# EAGLE design extension (EAGLE 9.0.0)
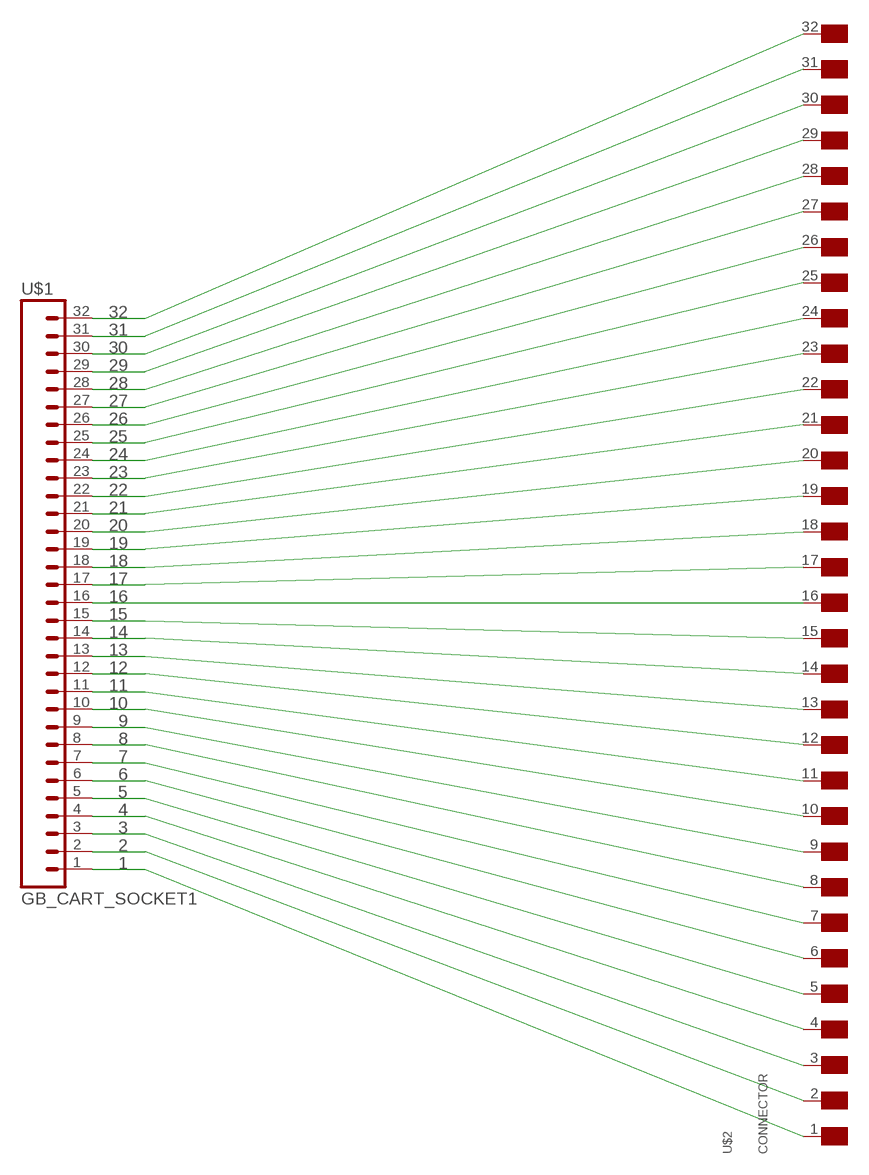
[diagram p0: schematic, sheet 1]

## Parts
U$1  GB_CART_SOCKET1  [GB_CART_SOCKET]
U$2  CONNECTOR  [CONNECTOR]

## Nets
1: U$1.1 U$2.1(VDD)
2: U$1.2 U$2.2(CLK)
3: U$1.3 U$2.3(/WR)
4: U$1.4 U$2.4(/RD)
5: U$1.5 U$2.5(/RCS)
6: U$1.6 U$2.6(A0)
7: U$1.7 U$2.7(A1)
8: U$1.8 U$2.8(A2)
9: U$1.9 U$2.9(A3)
10: U$1.10 U$2.10(A4)
11: U$1.11 U$2.11(A5)
12: U$1.12 U$2.12(A6)
13: U$1.13 U$2.13(A7)
14: U$1.14 U$2.14(A8)
15: U$1.15 U$2.15(A9)
16: U$1.16 U$2.16(A10)
17: U$1.17 U$2.17(A11)
18: U$1.18 U$2.18(A12)
19: U$1.19 U$2.19(A13)
20: U$1.20 U$2.20(A14)
21: U$1.21 U$2.21(A15)
22: U$1.22 U$2.22(D0)
23: U$1.23 U$2.23(D1)
24: U$1.24 U$2.24(D2)
25: U$1.25 U$2.25(D3)
26: U$1.26 U$2.26(D4)
27: U$1.27 U$2.27(D5)
28: U$1.28 U$2.28(D6)
29: U$1.29 U$2.29(D7)
30: U$1.30 U$2.30(/RS)
31: U$1.31 U$2.31(AUDIO)
32: U$1.32 U$2.32(GND)

## Library data of the parts
U$1 = gameboy:GB_CART_SOCKET
U$2 = gameboy:CONNECTOR: Connector Pads for Gameboy Cartridges

## Net classes
0 default: width 1.016 mm

## Board
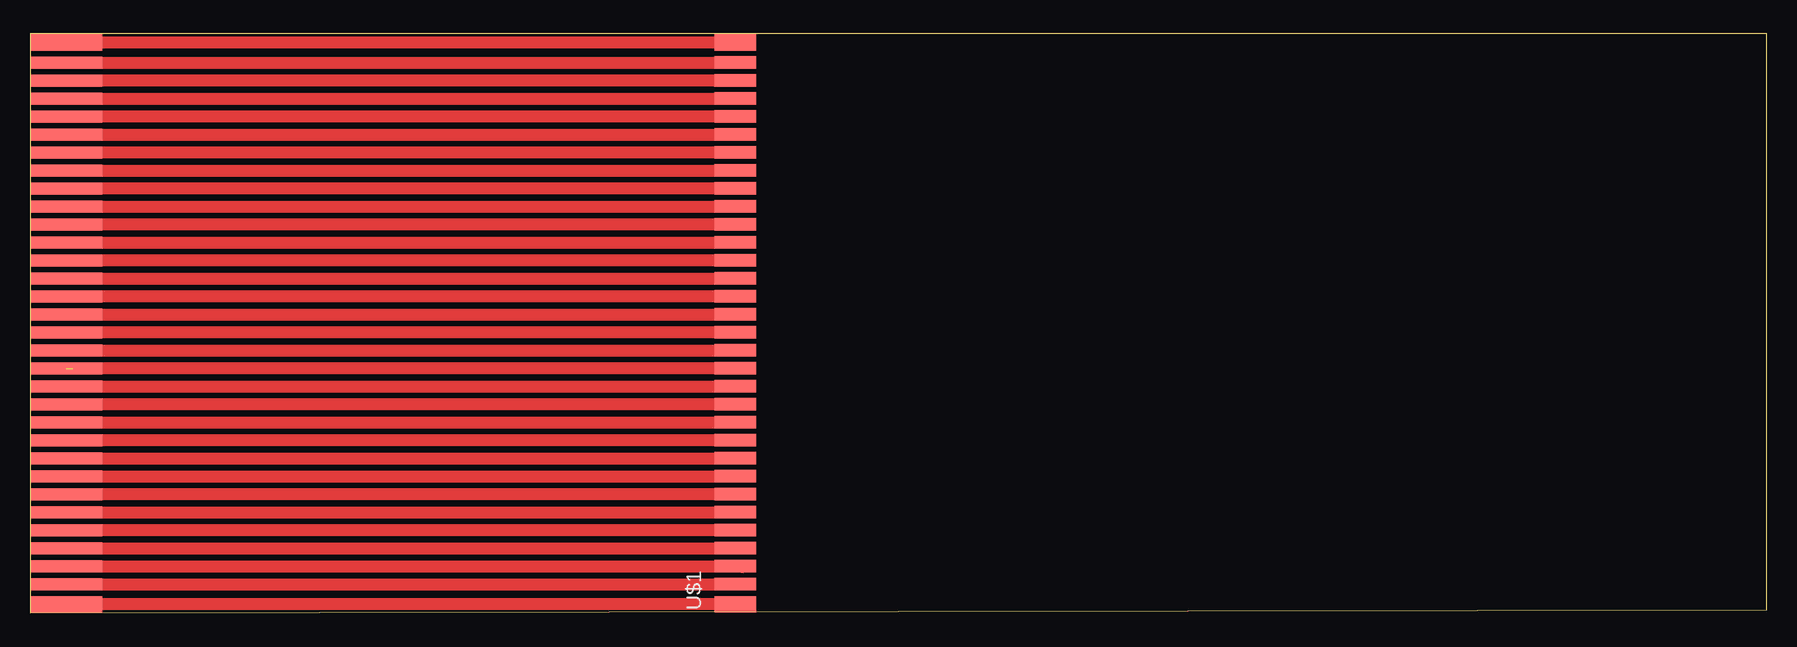
[diagram p1: board, top side]

Size 144.78 x 48.3 mm. Coordinates in mm from the lower left corner, seen from the top.
Outline: 0,0 144.78,0.25 144.78,48.3 0,48.3 0,0
Copper layers (1*16): Top 0.035mm / dielectric 1.5mm / Bottom 0.035mm
Design rules "default": minimum track width 6mil, minimum drill 0.35mm, track to track 6mil, track to pad 6mil, pad to pad 6mil, via to via 6mil, smd to smd 6mil, copper to edge 40mil, drill to drill 6mil, minimum pad ring 10mil, minimum via ring 8mil, stop-mask expansion 4mil, vias tented up to drill 0mil, thermal gap 10mil

### Footprints (pad centres in the part's own frame; a part is rotated, then mirrored left to right if it is on the bottom)
GB_CART_SOCKET = smd 1.36 x 3.46: 1 -22.895,-0.12; 32 23.94,-0.12 | smd 1.03 x 3.46: 2 -21.225,-0.12; 3 -19.725,-0.12; 4 -18.225,-0.12; 5 -16.725,-0.12; 6 -15.225,-0.12; 7 -13.725,-0.12; 8 -12.225,-0.12; 9 -10.725,-0.12; 10 -9.225,-0.12; 11 -7.725,-0.12; 12 -6.225,-0.12; 13 -4.725,-0.12; 14 -3.225,-0.12; 15 -1.725,-0.12; 16 -0.225,-0.12; 17 1.275,-0.12; 18 2.775,-0.12; 19 4.275,-0.12; 20 5.775,-0.12; 21 7.275,-0.12; 22 8.775,-0.12; 23 10.275,-0.12; 24 11.775,-0.12; 25 13.275,-0.12; 26 14.775,-0.12; 27 16.275,-0.12; 28 17.775,-0.12; 29 19.275,-0.12; 30 20.775,-0.12; 31 22.275,-0.12
CONNECTOR = smd 1.4 x 6: 1 0.7,-3; 32 47.6,-3 | smd 1 x 6: 2 2.4,-3; 3 3.9,-3; 4 5.4,-3; 5 6.9,-3; 6 8.4,-3; 7 9.9,-3; 8 11.4,-3; 9 12.9,-3; 10 14.4,-3; 11 15.9,-3; 12 17.4,-3; 13 18.9,-3; 14 20.4,-3; 15 21.9,-3; 16 23.4,-3; 17 24.9,-3; 18 26.4,-3; 19 27.9,-3; 20 29.4,-3; 21 30.9,-3; 22 32.4,-3; 23 33.9,-3; 24 35.4,-3; 25 36.9,-3; 26 38.4,-3; 27 39.9,-3; 28 41.4,-3; 29 42.9,-3; 30 44.4,-3; 31 45.9,-3

### Placement (x,y rotation side)
U$1  58.67,23.62 90 top
U$2  0,0 90 top

### Tracks (layer width: path | path; a pad name or v marks a point on that pad's centre or on a via)
1
  Top 1.016: U$1.1 3.03,0.73 U$2.1
2
  Top 0.152: U$1.2
  Top 1.016: U$2.2 U$1.2
3
  Top 1.016: U$2.3 59.3,3.9 | 59.36,3.83 59.3,3.9 | 59.3,3.9 U$1.3
4
  Top 1.016: U$2.4 U$1.4
5
  Top 1.016: U$1.5 U$2.5
6
  Top 1.016: U$2.6 U$1.6
7
  Top 1.016: U$1.7 U$2.7
8
  Top 1.016: U$2.8 U$1.8
9
  Top 1.016: U$2.9 U$1.9
10
  Top 1.016: U$1.10 U$2.10
11
  Top 1.016: U$2.11 U$1.11
12
  Top 1.016: U$1.12 U$2.12
13
  Top 1.016: U$2.13 U$1.13
14  (1 unrouted)
  Top 1.016: U$1.14 3.56,20.4
15
  Top 1.016: U$2.15 U$1.15
16
  Top 1.016: U$1.16 U$2.16
17
  Top 1.016: U$2.17 U$1.17
18
  Top 1.016: U$1.18 U$2.18
19
  Top 1.016: U$2.19 U$1.19
20
  Top 1.016: U$1.20 U$2.20
21
  Top 1.016: U$2.21 U$1.21
22
  Top 1.016: U$1.22 U$2.22
23
  Top 1.016: U$2.23 U$1.23
24
  Top 1.016: U$1.24 U$2.24
25
  Top 1.016: U$2.25 U$1.25
26
  Top 1.016: U$1.26 U$2.26
27
  Top 1.016: U$2.27 U$1.27
28
  Top 1.016: U$1.28 U$2.28
29
  Top 1.016: U$2.29 U$1.29
30
  Top 1.016: U$1.30 U$2.30
31
  Top 1.016: U$2.31 U$1.31
32
  Top 1.016: U$1.32 3.04,47.56 U$2.32